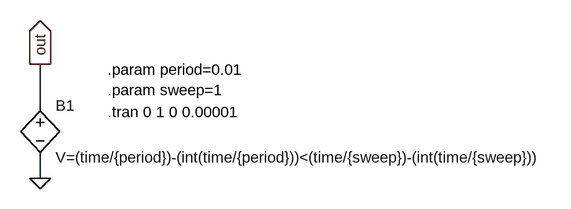
[diagram p0: schematic PwmSwept.asc]
PwmSwept.asc, the LTspice schematic file:
Version 4
SHEET 1 908 680
WIRE 32 144 32 80
WIRE 32 256 32 224
FLAG 32 256 0
FLAG 32 80 out
IOPIN 32 80 Out
SYMBOL Sources\\bv 32 128 R0
SYMATTR InstName B1
SYMATTR Value V=(time/{period})-(int(time/{period}))<(time/{sweep})-(int(time/{sweep}))
TEXT 136 88 Left 0 !.param period=0.01
TEXT 136 154 Left 0 !.tran 0 1 0 0.00001
TEXT 136 120 Left 0 !.param sweep=1

The netlist it stands for:
* PwmSwept.asc
B1 out 0 V=(time/{period})-(int(time/{period}))<(time/{sweep})-(int(time/{sweep}))
.param period=0.01
.tran 0 1 0 0.00001
.param sweep=1
.backanno
.end